# EAGLE design Driver (EAGLE 7.2.0)
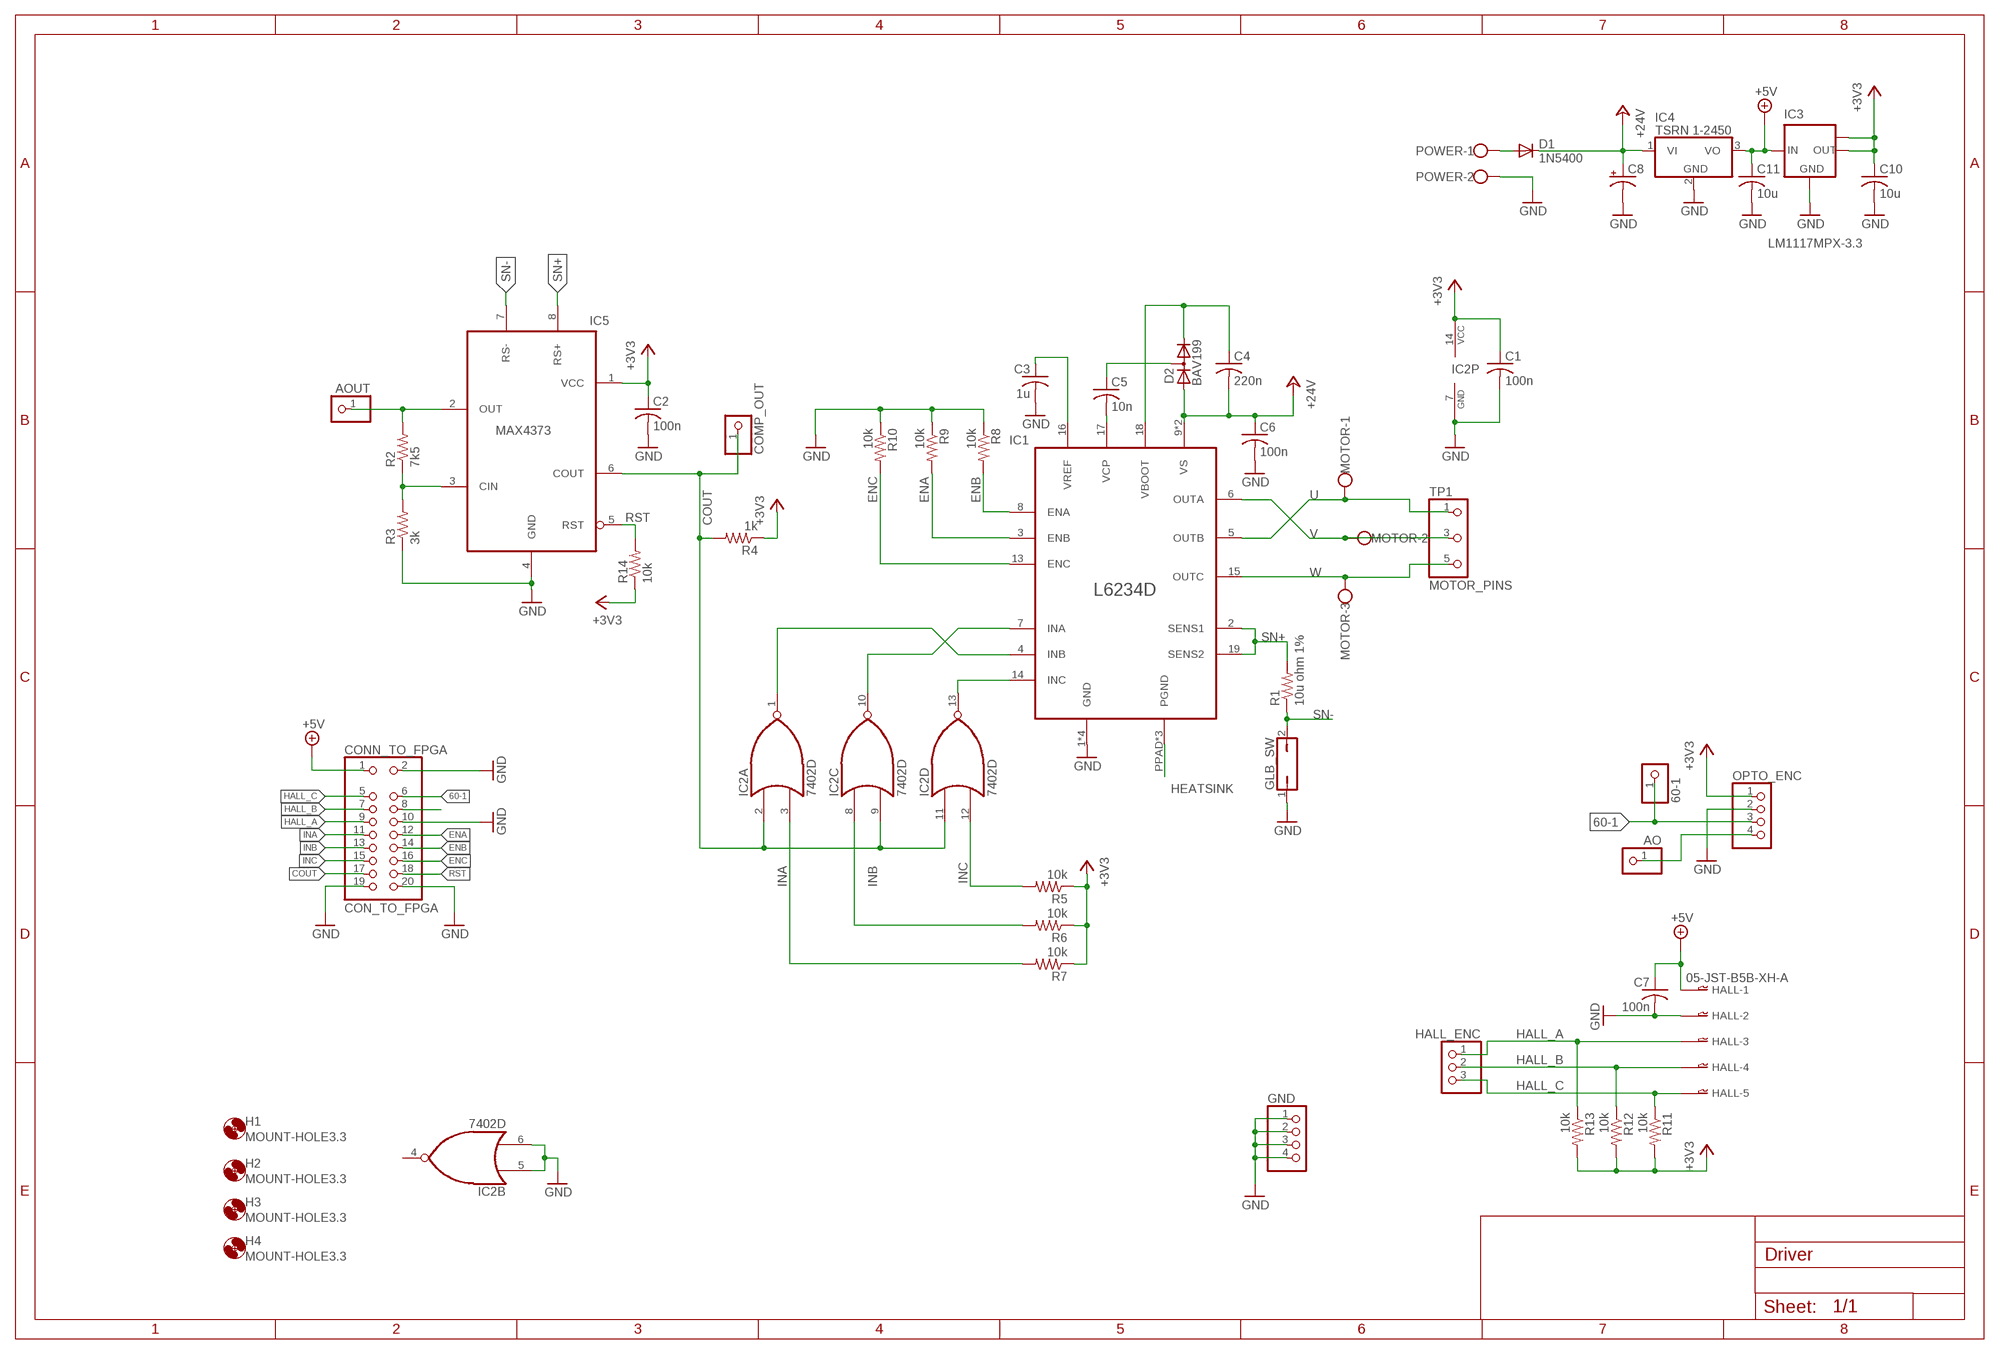
[diagram p0: schematic, sheet 1]

## Parts
60-1  PINHD-1X1  [1X01]
AO  PINHD-1X1  [1X01]
AOUT  PINHD-1X1  [1X01]
C1  100n  C-USC0805  [C0805]
C2  100n  C-USC0805  [C0805]
C3  1u  C-USC0805  [C0805]
C4  220n  C-USC0805  [C0805]
C5  10n  C-USC0805  [C0805]
C6  100n  C-USC0805  [C0805]
C7  100n  C-USC0805  [C0805]
C8  CPOL-USE5-13  [E5-13]
C10  10u  C-USC1206K  [C1206K]
C11  10u  C-USC1206K  [C1206K]
COMP_OUT  PINHD-1X1  [1X01]
CONN_TO_FPGA  CON_TO_FPGA  [2X10-2]
D1  1N5400  [DO201-15]
D2  BAV199  [SOT23]
GLB_SW  JP1Q  [JP1]
GND  PINHD-1X4  [1X04]
H1  MOUNT-HOLE3.3  [3,3]
H2  MOUNT-HOLE3.3  [3,3]
H3  MOUNT-HOLE3.3  [3,3]
H4  MOUNT-HOLE3.3  [3,3]
HALL  05-JST-B5B-XH-A  [B5B-XH]
HALL_ENC  PINHD-1X3  [1X03]
IC1  L6234D  [POWER_SO20]
IC2  7402D  [SO14]
IC3  LM1117MPX-3.3  [SOT223]
IC4  TSRN 1-2450  REG  [TSRN-1]
IC5  MAX4373  [SO-8]
MOTOR  W237-103  [W237-103]
OPTO_ENC  PINHD-1X4  [1X04]
POWER  W237-102  [W237-102]
R1  10u ohm 1%  R-US_R2512  [R2512]
R2  7k5  R-US_M1206  [M1206]
R3  3k  R-US_M1206  [M1206]
R4  1k  R-US_M1206  [M1206]
R5  10k  R-US_M1206  [M1206]
R6  10k  R-US_M1206  [M1206]
R7  10k  R-US_M1206  [M1206]
R8  10k  R-US_M1206  [M1206]
R9  10k  R-US_M1206  [M1206]
R10  10k  R-US_M1206  [M1206]
R11  10k  R-US_M1206  [M1206]
R12  10k  R-US_M1206  [M1206]
R13  10k  R-US_M1206  [M1206]
R14  10k  R-US_M1206  [M1206]
TP1  MOTOR_PINS  [PINSX3-200]

## Nets
60-1: 60-1.1 CONN_TO_FPGA.6 OPTO_ENC.3
+3V3: C1.1 C2.1 C10.1 IC2.14(P:VCC) IC3.2(OUT) IC3.TAB(OUT1) IC5.1(VCC) OPTO_ENC.1 R4.1 R5.1 R6.1 R7.1 R11.2 R12.2 R13.2 R14.1
+5V: C7.1 C11.1 CONN_TO_FPGA.1 HALL.P$1 IC3.3(IN) IC4.3(VO)
+24V: C4.2 C6.1 C8.+ D1.C D2.1(A) IC1.9(VS) IC1.12(VS) IC4.1(VI)
COUT: COMP_OUT.1 CONN_TO_FPGA.17 IC2.2(A:I0) IC2.9(C:I1) IC2.11(D:I0) IC5.6(COUT) R4.2
ENA: CONN_TO_FPGA.12 IC1.3(ENB) R9.2
ENB: CONN_TO_FPGA.14 IC1.8(ENA) R8.2
ENC: CONN_TO_FPGA.16 IC1.13(ENC) R10.2
GND: C1.2 C2.2 C3.2 C6.2 C7.2 C8.- C10.2 C11.2 CONN_TO_FPGA.2 CONN_TO_FPGA.10 CONN_TO_FPGA.19 CONN_TO_FPGA.20 GLB_SW.1 GND.1 GND.2 GND.3 GND.4 HALL.P$2 IC1.1(GND) IC1.10(GND) IC1.11(GND) IC1.20(GND) IC2.5(B:I0) IC2.6(B:I1) IC2.7(P:GND) IC3.1(GND) IC4.2(GND) IC5.4(GND) OPTO_ENC.2 POWER.2 R3.1 R8.1 R9.1 R10.1
HALL_A: CONN_TO_FPGA.9 HALL.P$3 HALL_ENC.1 R13.1
HALL_B: CONN_TO_FPGA.7 HALL.P$4 HALL_ENC.2 R12.1
HALL_C: CONN_TO_FPGA.5 HALL.P$5 HALL_ENC.3 R11.1
HEATSINK: IC1.PPAD1(PGND) IC1.PPAD2(PGND) IC1.PPAD(PGND)
INA: CONN_TO_FPGA.11 IC2.3(A:I1) R7.2
INB: CONN_TO_FPGA.13 IC2.8(C:I0) R6.2
INC: CONN_TO_FPGA.15 IC2.12(D:I1) R5.2
N$1: D1.A POWER.1
N$2: IC1.14(INC) IC2.13(D:O)
N$3: IC1.7(INA) IC2.10(C:O)
N$4: IC1.4(INB) IC2.1(A:O)
N$6: IC5.3(CIN) R2.1 R3.2
N$7: C3.1 IC1.16(VREF)
N$8: AOUT.1 IC5.2(OUT) R2.2
N$9: AO.1 OPTO_ENC.4
N$12: CONN_TO_FPGA.8
N$18: C5.1 D2.3(AC)
N$19: C4.1 D2.2(C) IC1.18(VBOOT)
N$21: C5.2 IC1.17(VCP)
RST: CONN_TO_FPGA.18 IC5.5(RST) R14.2
SN+: IC1.2(SENS1) IC1.19(SENS2) IC5.8(RS+) R1.2
SN-: GLB_SW.2 IC5.7(RS-) R1.1
U: IC1.5(OUTB) MOTOR.1 TP1.1
V: IC1.6(OUTA) MOTOR.2 TP1.3
W: IC1.15(OUTC) MOTOR.3 TP1.5
Unconnected: IC2.4(B:O)

## Library data of the parts
60-1 AO AOUT COMP_OUT = pinhead:PINHD-1X1: PIN HEADER
C1-C7 C10 C11 = rcl:C-US: CAPACITOR, American symbol
C8 = rcl:CPOL-US: POLARIZED CAPACITOR, American symbol
CONN_TO_FPGA = parts:CON_TO_FPGA
D1 = diode:1N5400: DIODE standard rectifier, 3 A, 50 V (Motorola)
D2 = diode:BAV199: DIODE low-leakage double diode
GLB_SW = jumper:JP1Q: JUMPER
GND OPTO_ENC = pinhead:PINHD-1X4: PIN HEADER
H1-H4 = holes:MOUNT-HOLE: MOUNTING HOLE with drill center marker
HALL = bt_con-jst-xh:05-JST: JST CONNECTOR
HALL_ENC = pinhead:PINHD-1X3: PIN HEADER
IC1 = parts:L6234D
IC2 = 74xx-us:74*02: Quad 2-input NOR gate
IC3 = lm1117:LM1117MPX-*
IC4 = parts:REG: The new TSRN-1 series step-down switching regulators are drop-in replacement for inefficient 78xx linear regulators. A high efficiency up to 95 % allows full load operation up to +70°C (+85°C with derating) ambient temperature without the need of any heat-sink or forced air cooling. The TSRN-1 switching regulators provide other significant features over linear regu - lators, i.e. better output accuracy (±2 %), lower standby current of ~2 mA and no requirement of external capacitors. They are suitable for positive or negative output circuits. The high efficiency and low standby power consumption make these regula - tors an ideal solution for energy sensitive applications.; TH: TSRN 1-2450
IC5 = parts:MAX4373
MOTOR = con-wago-500:W237-103: WAGO SCREW CLAMP; MPN: 237-103; OC_FARNELL: unknown; OC_NEWARK: 18M7116
POWER = con-wago-500:W237-102: WAGO SCREW CLAMP; MPN: 237-102; OC_FARNELL: unknown; OC_NEWARK: 70K9898
R1-R14 = rcl:R-US_: RESISTOR, American symbol
TP1 = parts:MOTOR_PINS

## Board
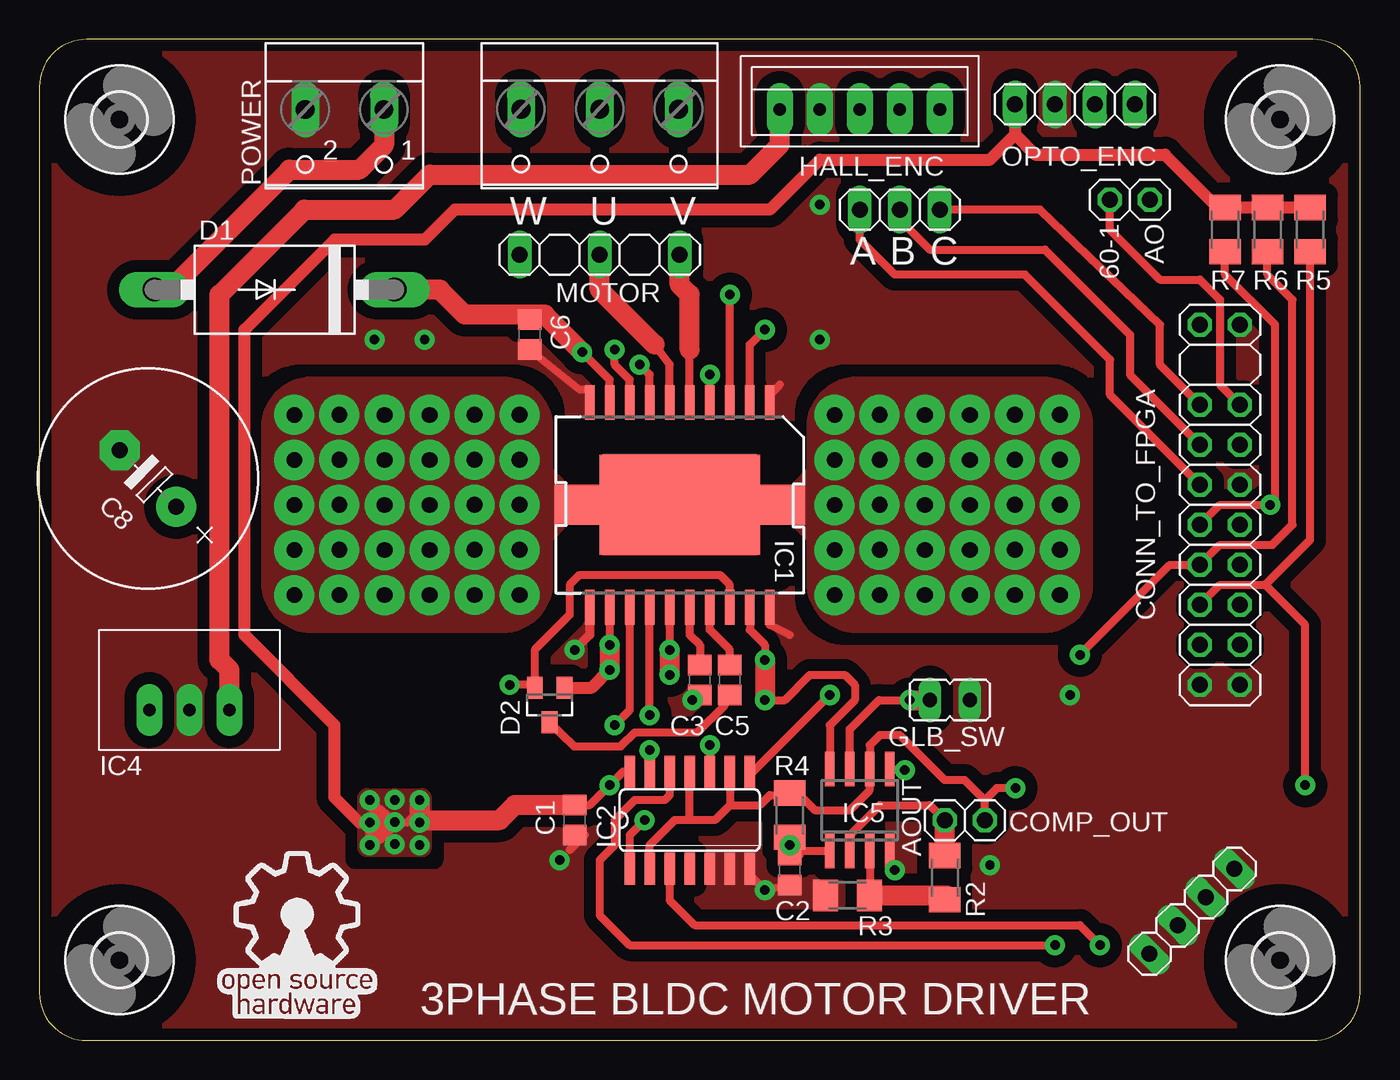
[diagram p1: board, top side]
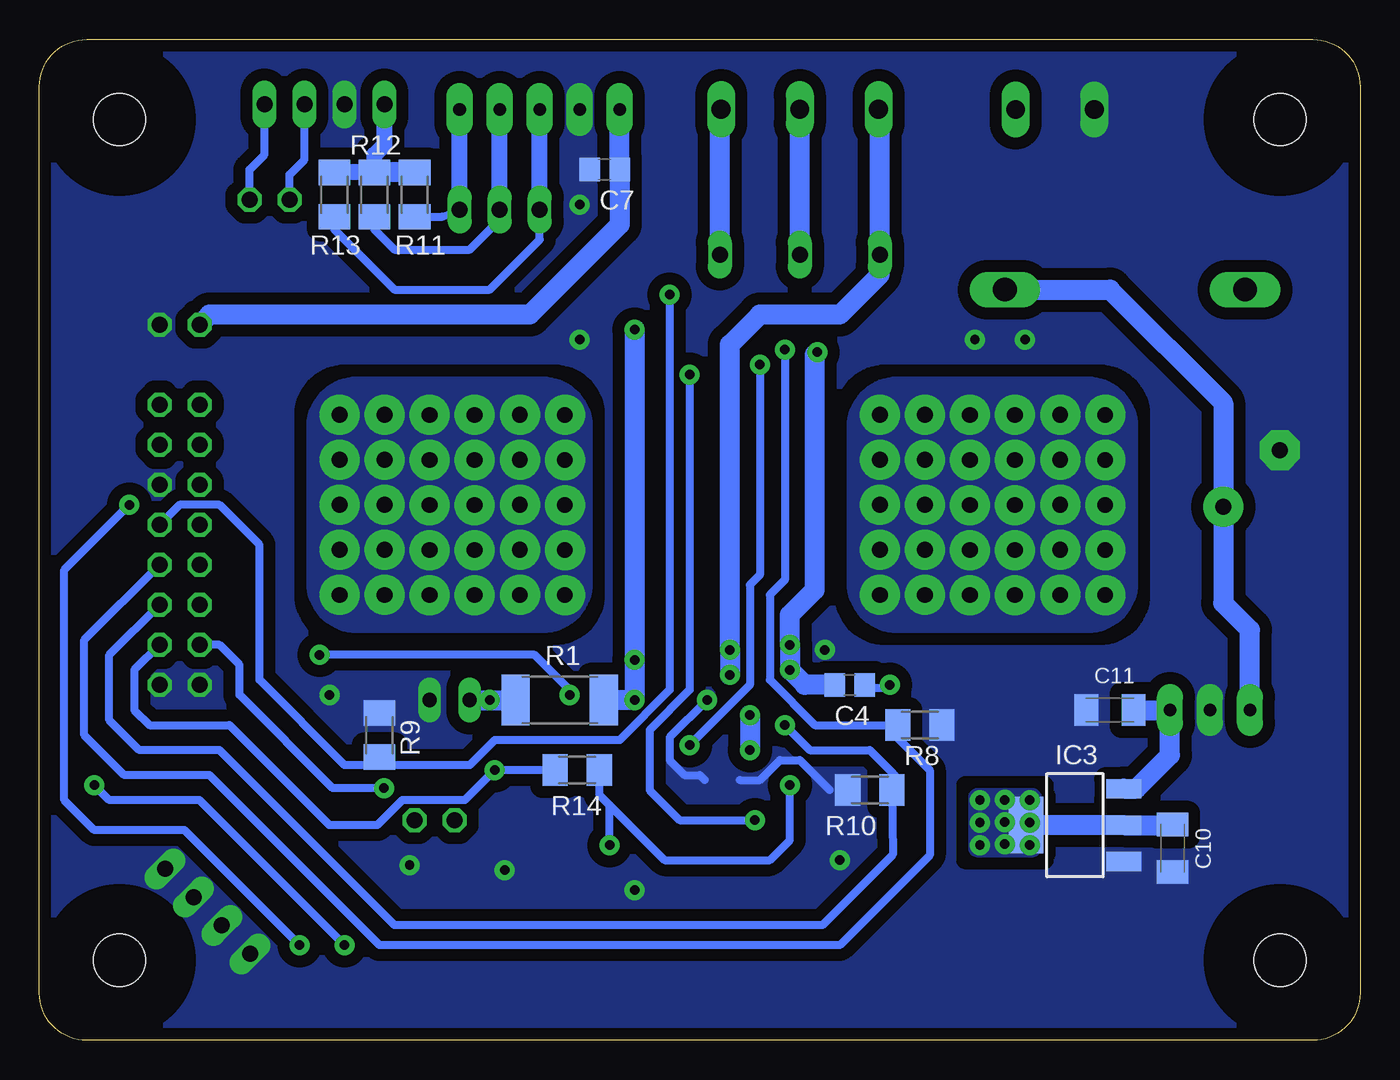
[diagram p2: board, bottom side, seen from below]

Size 83.82 x 63.5 mm. Coordinates in mm from the lower left corner, seen from the top.
Outline: 3,0 80.82,0 arc90 83.82,3 83.82,60.5 arc90 80.82,63.5 3,63.5 arc90 0,60.5 0,3 arc90 3,0
Copper layers (1*16): Top 0.035mm / dielectric 1.5mm / Bottom 0.035mm
Design rules "default *": minimum track width 10mil, minimum drill 10mil, track to track 8mil, track to pad 8mil, pad to pad 8mil, via to via 8mil, smd to smd 0mil, copper to edge 20mil, drill to drill 8mil, minimum pad ring 10mil, minimum via ring 8mil, stop-mask expansion 4mil, vias tented up to drill 0mil, thermal gap 10mil
tRestrict: area 34,29.8 to 46.7,38.3

### Footprints (pad centres in the part's own frame; a part is rotated, then mirrored left to right if it is on the bottom)
1X01 = drill 1.016 octagon: 1 0,0
C0805 = smd 1.3 x 1.5: 1 -0.95,0; 2 0.95,0
E5-13 = drill 1.016 pad 2.54: + -2.54,0 | drill 1.016 pad 2.54 octagon: - 2.54,0
C1206K = smd 1.5 x 2: 1 -1.5,0; 2 1.5,0
2X10-2 = drill 1.016 octagon: 1 -11.43,-1.27; 2 -11.43,1.27; 5 -6.35,-1.27; 6 -6.35,1.27; 7 -3.81,-1.27; 8 -3.81,1.27; 9 -1.27,-1.27; 10 -1.27,1.27; 11 1.27,-1.27; 12 1.27,1.27; 13 3.81,-1.27; 14 3.81,1.27; 15 6.35,-1.27; 16 6.35,1.27; 17 8.89,-1.27; 18 8.89,1.27; 19 11.43,-1.27; 20 11.43,1.27
DO201-15 = drill 1.499 long: A 7.62,0; C -7.62,0
SOT23 = smd 1 x 1.4: 1 -0.95,-1.1; 2 0.95,-1.1; 3 0,1.1
JP1 = drill 0.914 long: 1 0,-1.27; 2 0,1.27
1X04 = drill 1.016 long: 1 -3.81,0; 2 -1.27,0; 3 1.27,0; 4 3.81,0
3,3 = hole 3.3: 0,0
B5B-XH = drill 0.8 pad 1.676 long: P$1 -5.08,0; P$2 -2.54,0; P$3 0,0; P$4 2.54,0; P$5 5.08,0
1X03 = drill 1.016 long: 1 -2.54,0; 2 0,0; 3 2.54,0
POWER_SO20 = smd 0.6 x 2.2: 1 -5.715,-6.5; 2 -4.445,-6.5; 3 -3.175,-6.5; 4 -1.905,-6.5; 5 -0.635,-6.5; 6 0.635,-6.5; 7 1.905,-6.5; 8 3.175,-6.5; 9 4.445,-6.5; 10 5.715,-6.5; 11 5.715,6.5; 12 4.445,6.5; 13 3.175,6.5; 14 1.905,6.5; 15 0.635,6.5; 16 -0.635,6.5; 17 -1.905,6.5; 18 -3.175,6.5; 19 -4.445,6.5; 20 -5.715,6.5 | smd 10.16 x 6.35: PPAD 0,0 | smd 5.08 x 2.54: PPAD1 -5.397,0; PPAD2 5.397,0
SO14 = smd 0.66 x 2.032: 1 -3.81,-3.073; 2 -2.54,-3.073; 3 -1.27,-3.073; 4 0,-3.073; 5 1.27,-3.073; 6 2.54,-3.073; 7 3.81,-3.073; 8 3.81,3.073; 9 2.54,3.073; 10 1.27,3.073; 11 0,3.073; 12 -1.27,3.073; 13 -2.54,3.073; 14 -3.81,3.073
SOT223 = smd 1.219 x 2.235: 1 -2.311,-3.099; 2 0,-3.099; 3 2.311,-3.099 | smd 3.6 x 2.2: TAB 0,3.099
TSRN-1 = drill 0.8 pad 1.651 long: 1 -2.54,-2.54; 2 0,-2.54; 3 2.54,-2.54
SO-8 = smd 0.6 x 2.2: 1 -1.905,-2.6; 2 -0.635,-2.6; 3 0.635,-2.6; 4 1.905,-2.6; 5 1.905,2.6; 6 0.635,2.6; 7 -0.635,2.6; 8 -1.905,2.6
W237-103 = drill 1.194 long: 1 -5,-1.29; 2 0,-1.29; 3 5,-1.29
W237-102 = drill 1.194 long: 1 -2.5,-1.27; 2 2.5,-1.27
R2512 = smd 1.8 x 3.2: 1 -2.8,0; 2 2.8,0
M1206 = smd 1.6 x 2: 1 -1.4,0; 2 1.4,0
PINSX3-200 = drill 1.016 long: 1 -5.08,0; 3 0,0; 5 5.08,0

### Placement (x,y rotation side)
60-1  67.94,53.34 0 top
AO  70.48,53.34 0 top
AOUT  57.47,13.97 0 top
C1  33.97,13.97 270 top
C2  47.62,10.79 270 top
C3  41.91,22.86 270 top
C4  32.38,22.54 180 bottom
C5  43.81,22.86 90 top
C6  31.11,44.77 270 top
C7  47.94,55.24 180 bottom
C8  6.89,35.65 135 top
C10  11.91,12.18 270 bottom
C11  15.88,20.95 180 bottom
COMP_OUT  60.01,13.97 0 top
CONN_TO_FPGA  74.93,33.97 270 top
D1  14.92,47.62 180 top
D2  32.38,21.27 180 top
GLB_SW  57.78,21.59 90 top
GND  73.14,8.18 45 top
H1  5.08,58.42 0 top
H2  78.74,58.42 0 top
H3  5.08,5.08 0 top
H4  78.74,5.08 0 top
HALL  52.07,59.05 0 top
HALL_ENC  54.61,52.7 0 top
IC1  40.64,33.97 180 top
IC2  41.27,13.97 0 top
IC3  18.1,13.65 90 bottom
IC4  9.53,23.5 0 top
IC5  52.07,14.61 0 top
MOTOR  35.56,57.78 180 top
OPTO_ENC  65.72,59.37 0 top
POWER  19.37,57.78 180 top
R1  50.8,21.59 0 bottom
R2  57.47,10.32 90 top
R3  51.28,9.2 0 top
R4  47.62,14.29 90 top
R5  80.64,51.44 270 top
R6  77.94,51.44 270 top
R7  75.25,51.44 270 top
R8  27.94,20 180 bottom
R9  62.23,19.37 270 bottom
R10  31.11,15.88 0 bottom
R11  60.01,53.66 90 bottom
R12  62.55,53.66 90 bottom
R13  65.09,53.66 90 bottom
R14  49.69,17.14 180 bottom
TP1  35.56,49.85 180 top

### Tracks (layer width: path | path; a pad name or v marks a point on that pad's centre or on a via)
60-1
  Top 0.508: 60-1.1 67.94,51.44 71.12,48.26 73.66,48.26 74.93,46.99 74.93,41.59 CONN_TO_FPGA.6
  Bottom 0.508: 60-1.1 67.94,54.93 66.99,55.88 OPTO_ENC.3
+3V3  (via drill 0.6 pad 1.27)
  Top 0.508: IC5.1 48.2,12.01 48.26,11.74 C2.1 47.62,12.06 47.31,12.38 | 47.31,12.38 47.62,12.7 R4.1 v47.62,12.38 | 47.31,12.38 47.31,12.7 47.62,13.02 | C1.1 34.92,14.92 v36.2,16.19 37.05,17.04 IC2.14 | 24.45,14.92 23.33,13.81 22.7,13.81 | 22.7,13.81 22.06,13.81 | 22.06,13.81 v20.96,13.81 | v20.96,13.81 21.27,14.29 | 21.27,14.29 v20.96,15.23 22.7,13.81 | v20.96,12.39 v20.96,13.81 | 22.7,13.81 21.59,12.7 v20.96,12.39 | v20.96,12.39 21.27,13.02 22.06,13.81 | 22.06,13.81 21.27,14.29
  Top 0.762: v20.96,13.81 20.32,13.81 18.73,15.4 18.73,20 13.02,25.72 13.02,45.09 18.73,50.8 24.45,50.8 26.35,52.7 46.35,52.7 49.53,55.88 60.33,55.88 61.91,57.46 61.91,57.47 | OPTO_ENC.1 61.91,57.47 | 61.91,57.47 63.18,56.2 71.44,56.2 75.12,52.52 R7.1 R6.1 R5.1
  Top 1.27: C1.1 30.16,14.92 29.21,13.97 24.13,13.97 v24.13,15.24
  Bottom 0.508: 48.26,16.83 48.26,16.96 R14.1 48.26,17.11 48.26,15.56 47.62,14.92 | v47.62,12.38 47.62,14.92 | 47.62,14.92 44.13,11.43 37.47,11.43 36.2,12.7 v36.2,16.19 | IC3.TAB 20,13.65 v20.96,15.23 v20.96,13.81 | v20.96,12.39 v20.96,13.81 | IC3.2 v20.96,13.81
  Bottom 1.016: R11.2 R12.2 | R12.2 R13.2 | R12.2 62.55,55.24 62.55,56.2 61.91,56.83 OPTO_ENC.1
  Bottom 1.27: IC3.TAB IC3.2 11.94,13.65 C10.1 | R11.2 62.36,55.06 62.55,55.24
  other vias: 22.56,15.25 24.13,13.81 24.13,12.39 22.56,12.45 22.56,13.85
  pour Top: 24.77,15.37 24.77,12.25 arc-90 24.26,11.74 20.83,11.74 arc-90 20.32,12.25 20.32,15.37 arc-90 20.83,15.88 24.26,15.88 arc-90
  pour Bottom (no thermals): 24.26,11.74 20.83,11.74 arc-90 20.32,12.25 20.32,15.37 arc-90 20.83,15.88 24.26,15.88 arc-90 24.77,15.37 24.77,12.25 arc-90
  pour Bottom (no thermals): 24.26,11.74 20.83,11.74 arc-90 20.32,12.25 20.32,15.37 arc-90 20.83,15.88 24.26,15.88 arc-90 24.77,15.37 24.77,12.25 arc-90
+5V
  Top 1.27: IC4.3 12.06,23.5 11.43,24.13 11.43,47.31 16.83,52.7 22.54,52.7 24.77,54.93 45.09,54.93 46.99,56.83 HALL.P$1
  Bottom 1.27: IC3.3 14.2,15.96 12.06,18.1 IC4.3 C11.1 | HALL.P$1 C7.1 46.99,51.75 52.7,46.04 73.03,46.04 CONN_TO_FPGA.1
+24V  (via drill 0.6 pad 1.27)
  Top 0.508: IC1.12 v36.2,25.08 | IC1.9 36.2,41.91 v34.45,43.66 | C6.1 31.43,45.72 31.75,46.04
  Top 0.762: D2.1 35.07,22.37 v36.2,23.5
  Top 1.27: v34.45,43.66 32.07,46.04 31.75,46.04 26.99,46.04 25.4,47.62 D1.C | v36.2,25.08 v36.2,23.5
  Bottom 1.27: D1.C 15.88,47.62 8.69,40.44 C8.+ 8.69,27.74 6.99,26.04 IC4.1 | v34.45,43.66 34.61,43.5 34.61,28.57 36.2,26.99 v36.2,25.08 v36.2,23.5 35.24,22.54 C4.2
COUT  (via drill 0.6 pad 1.27)
  Top 0.508: COMP_OUT.1 60.01,15.24 | 60.01,15.24 58.74,16.51 57.47,16.51 54.61,19.37 53.34,19.37 52.7,18.73 IC5.6 52.7,15.88 51.44,14.61 49.21,14.61 47.81,16 R4.2 47.18,15.56 46.35,15.56 45.72,14.92 43.81,14.92 | 60.01,15.24 60.76,16 v61.94,16 | 41.27,13.97 IC2.11 | 41.27,13.97 42.86,13.97 43.81,14.92 | 41.27,13.97 40.32,13.97 38.73,12.38 IC2.2 | IC2.9 43.81,14.92
  Bottom 0.508: CONN_TO_FPGA.17 72.39,25.08 71.12,23.81 71.12,21.91 65.21,16 v61.94,16
ENA  (via drill 0.6 pad 1.27)
  Top 0.508: IC1.3 v43.81,47.31
  Bottom 0.508: v43.81,47.31 43.81,22.23 46.99,19.05 54.93,19.05 56.52,17.46 61.59,17.46 R9.2 | R9.2 61.91,17.46 | CONN_TO_FPGA.12 74.93,33.97 72.39,33.97 69.85,31.43 69.85,22.86 64.45,17.46 63.18,17.46 62.68,17.97 R9.2
ENB  (via drill 0.6 pad 1.27)
  Top 0.508: IC1.8 37.47,41.91 36.51,42.86 v36.51,43.81
  Bottom 0.508: v36.51,43.81 36.51,29.21 37.47,28.26 37.47,22.86 34.61,20 29.53,20 | 29.53,20 R8.2 | 29.53,20 29.53,19.37 27.3,17.14 27.3,11.75 33.02,6.03 62.23,6.03 73.03,16.83 78.42,16.83 80.96,19.37 80.96,25.4 CONN_TO_FPGA.14
ENC  (via drill 0.6 pad 1.27)
  Top 0.508: IC1.13 37.47,20.95 v36.51,20
  Bottom 0.508: v36.51,20 34.92,18.41 31.11,18.41 29.66,16.96 R10.2 | R10.2 29.53,16.83 | R10.2 29.66,11.78 34.14,7.3 61.28,7.3 72.39,18.41 77.47,18.41 79.38,20.32 79.38,24.45 CONN_TO_FPGA.16
GND  (via drill 0.6 pad 1.27)
  Top 0.508: IC1.10 34.92,41.27 34.29,41.27 C6.2 | IC1.1 46.35,40.96 46.99,41.59 | 34.92,25.72 v33.97,24.77 | IC1.20 46.35,26.35 47.62,25.72 | C2.2 v46.04,9.53 45.09,10.48 IC2.7 | C1.2 34.61,13.02 33.66,12.06
  Top 0.584: IC1.11 34.92,25.72 34.29,25.08
  Bottom 0.508: v41.44,21.59 43.81,19.21 43.81,17.78 42.86,16.83 41.91,16.83 41.59,16.51 | 39.37,16.51 38.1,16.51 36.83,17.78 35.56,17.78 33.66,15.88
  other vias: 21.27,44.45 24.45,44.45 54.29,10.79 49.53,44.45 33.02,11.43 60.33,11.11 49.53,53.02 65.41,21.91
  pour Bottom (isolate 0.762, rank 2, no thermals): 0,63.5 83.82,63.5 83.82,0 0,0
  pour Top (isolate 0.762, rank 2, no thermals): 0,63.5 83.82,63.5 83.82,0 0,0
HALL_A
  Top 0.508: CONN_TO_FPGA.9 67.94,40.96 67.94,43.18 62.55,48.58 54.29,48.58 52.07,50.8 HALL_ENC.1
  Bottom 0.508: R13.1 65.09,51.44 61.28,47.62 55.24,47.62 52.07,50.8 HALL_ENC.1
  Bottom 1.016: HALL_ENC.1 HALL.P$3
HALL_B
  Top 0.508: HALL_ENC.2 54.61,52.07 56.52,50.16 63.82,50.16 69.22,44.77 69.22,42.23 CONN_TO_FPGA.7
  Bottom 0.508: R12.1 62.55,51.44 61.28,50.16 56.52,50.16 54.61,52.07 HALL_ENC.2
  Bottom 1.016: HALL_ENC.2 HALL.P$4
HALL_C
  Top 0.508: HALL_ENC.3 63.5,52.7 71.12,45.4 71.12,42.86 CONN_TO_FPGA.5
  Bottom 0.508: R11.1 58.23,52.26 HALL_ENC.3
  Bottom 1.016: HALL_ENC.3 HALL.P$5
HEATSINK  (via drill 1 pad 2.54)
  Top 0.508: IC1.PPAD2 IC1.PPAD IC1.PPAD1
  other vias: 16.18,39.67 19.04,39.69 21.91,39.67 24.77,39.67 27.62,39.69 30.48,39.69 16.18,36.82 19.04,36.83 21.91,36.82 24.77,36.82 27.62,36.83 30.48,36.83 16.18,33.96 19.04,33.97 21.91,33.96 24.77,33.96 27.62,33.97 30.48,33.97 16.18,31.1 19.04,31.11 21.91,31.1 24.77,31.1 27.62,31.11 30.48,31.11 16.18,28.24 19.04,28.26 21.91,28.24 24.77,28.24 27.62,28.26 30.48,28.26 50.47,28.24 53.33,28.26 56.2,28.24 59.05,28.24 61.91,28.26 64.77,28.26 50.47,31.1 53.33,31.11 56.2,31.1 59.05,31.1 61.91,31.11 64.77,31.11 50.47,33.96 53.33,33.97 56.2,33.96 59.05,33.96 61.91,33.97 64.77,33.97 50.47,36.82 53.33,36.83 56.2,36.82 59.05,36.82 61.91,36.83 64.77,36.83 50.47,39.67 53.33,39.69 56.2,39.67 59.05,39.67 61.91,39.69 64.77,39.69
  pour Top (no thermals): 66.67,38.91 66.67,29.04 arc-90 63.67,26.04 51.9,26.04 arc-90 48.9,29.04 48.9,31.75 47.94,32.7 47.94,35.24 48.9,36.2 48.9,38.91 arc-90 51.9,41.91 63.67,41.91 arc-90
  pour Top (no thermals): 14.29,29.04 14.29,38.91 arc-90 17.29,41.91 29.39,41.91 arc-90 32.38,38.91 32.38,36.2 33.34,35.24 33.34,32.7 32.38,31.75 32.38,29.04 arc-90 29.39,26.04 17.29,26.04 arc-90
  pour Bottom: 48.9,29.04 48.9,38.91 arc-90 51.9,41.91 63.67,41.91 arc-90 66.67,38.91 66.67,29.04 arc-90 63.67,26.04 51.9,26.04 arc-90
  pour Bottom: 14.29,29.04 14.29,38.91 arc-90 17.29,41.91 29.39,41.91 arc-90 32.38,38.91 32.38,29.04 arc-90 29.39,26.04 17.29,26.04 arc-90
INA  (via drill 0.6 pad 1.27)
  Top 0.508: IC2.3 40.01,8.89 41.59,7.3 66.04,7.3 v67.31,6.03 | CONN_TO_FPGA.11 74.93,33.97 v78.11,33.97 78.42,34.29 78.42,45.4 75.25,48.58 R7.2
  Bottom 0.508: v67.31,6.03 74.61,13.34 80.33,13.34 82.23,15.24 82.23,29.84 v78.11,33.97
INB  (via drill 0.6 pad 1.27)
  Top 0.508: IC2.8 45.3,17.04 v50.16,21.91 | v66.04,24.45 71.75,30.16 CONN_TO_FPGA.13 74.93,31.43 78.26,31.43 79.53,32.7 79.53,46.99 77.94,48.58 R6.2
  Bottom 0.508: v66.04,24.45 52.39,24.45 50.16,22.23 v50.16,21.91
INC  (via drill 0.6 pad 1.27)
  Top 0.508: IC2.12 40.01,15.56 39.69,15.24 37.78,15.24 36.51,13.97 36.51,12.38 35.56,11.43 35.56,7.94 37.47,6.03 v64.45,6.03 | CONN_TO_FPGA.15 74.93,28.89 77.79,28.89 | 77.79,28.89 80.64,31.75 R5.2 80.64,50.16 | v80.33,16.19 80.33,26.35 77.79,28.89
  Bottom 0.508: v64.45,6.03 73.66,15.24 79.38,15.24 v80.33,16.19
N$1
  Top 1.27: D1.A 8.26,47.62 15.88,55.24 20.32,55.24 21.87,56.79 POWER.1
N$2  (via drill 0.6 pad 1.27)
  Top 0.508: IC2.13 v38.73,18.41 | v38.73,20.64 IC1.14
  Bottom 1.27: v38.73,20.64 v38.73,18.41
N$3  (via drill 0.6 pad 1.27)
  Top 0.508: IC1.7 38.73,42.23 v38.1,42.86 | v42.55,18.73 IC2.10
  Bottom 0.508: v38.1,42.86 38.1,29.53 38.73,28.89 38.73,22.54 v42.55,18.73
N$4  (via drill 0.6 pad 1.27)
  Top 0.508: IC1.4 v42.55,42.23 | v38.42,13.97 37.47,13.02 IC2.1
  Bottom 0.508: v42.55,42.23 42.55,22.23 45.09,19.68 45.09,15.88 43.18,13.97 v38.42,13.97
N$6
  Top 0.508: IC5.3 52.7,8.91 R3.2
  Top 1.27: R3.2 57.59,9.2 R2.1
N$7
  Top 0.508: IC1.16 41.27,25.72 41.91,25.08 C3.1
N$8
  Top 0.508: IC5.2 51.44,13.02 53.34,14.92 56.52,14.92 AOUT.1
  Top 1.27: R2.2 AOUT.1
N$9
  Bottom 0.508: AO.1 70.48,55.24 69.53,56.2 OPTO_ENC.4
N$18
  Top 0.508: 32.38,20 D2.3 33.02,19.54 33.02,19.52 33.06,19.52 33.94,18.64 36.9,18.64 37.78,19.52 41.75,19.52 43.5,21.27 43.5,21.59 C5.1
N$19  (via drill 0.6 pad 1.27)
  Top 0.508: IC1.18 43.81,28.89 43.18,29.53 34.29,29.53 33.66,28.89 33.66,26.99 31.43,24.77 D2.2 31.27,22.54 v29.84,22.54
  Bottom 0.508: C4.1 D2.2 30.02,22.37 v29.84,22.54
N$21
  Top 0.508: C5.2 43.81,24.77 42.55,26.04 IC1.17
RST  (via drill 0.6 pad 1.27)
  Top 0.508: IC5.5 54.87,17.2 v54.93,17.14
  Bottom 0.508: R14.2 v54.93,17.14 56.83,15.24 60.8,15.24 62.39,13.65 65.41,13.65 71.75,20 76.83,20 77.79,20.95 77.79,23.5 CONN_TO_FPGA.18
SN+  (via drill 0.6 pad 1.27)
  Top 0.508: IC1.19 45.09,26.04 46.04,25.08 v46.04,24.13 | IC1.2 45.09,44.13 v46.04,45.09 | v46.04,21.59 47.31,21.59 48.9,23.18 51.12,23.18 51.75,22.54 51.75,21.59 50.16,20 IC5.8
  Top 1.27: v46.04,24.13 v46.04,21.59
  Bottom 1.27: R1.2 v46.04,21.59 v46.04,24.13 v46.04,45.09
SN-  (via drill 0.6 pad 1.27)
  Top 0.508: IC5.7 51.44,19.74 53.28,21.59 v55.24,21.59
  Top 1.27: v55.24,21.59 GLB_SW.2
  Bottom 1.27: GLB_SW.2 v55.24,21.59 R1.1
U
  Top 0.508: IC1.5 41.27,43.81
  Top 1.27: 41.27,43.81 41.27,47.31 40.64,47.94 TP1.1
  Bottom 1.27: TP1.1 40.64,58.04 MOTOR.1
V
  Top 0.508: IC1.6 40.01,42.86 39.05,44.13
  Top 1.27: 39.05,44.13 35.56,47.62 TP1.3
  Bottom 1.27: TP1.3 MOTOR.2
W  (via drill 0.6 pad 1.27)
  Top 0.508: IC1.15 v40.01,24.77
  Top 1.27: v40.01,24.77 v40.01,23.18
  Bottom 1.27: MOTOR.3 30.48,58.04 TP1.5 30.48,48.58 33.02,46.04 38.1,46.04 40.01,44.13 v40.01,24.77 v40.01,23.18

### Text on the board
tPlace: W | U | V
tNames: A | B | C | 3PHASE BLDC MOTOR DRIVER